# Altium schematic sheet Power.SchDoc: Sample Sheet Title
size B; Date: MM/DD/YYYY; Author: Sample Author; Organization: ORGANIZATION; Address1: ADDRESS 1; Address2: ADDRESS 2; Address3: ADDRESS 3; Address4: ADDRESS 4; Revision: -; SheetNumber: 5; SheetTotal: 7; ENG_APP_DATE: --/--/--; DSN_APP_DATE: --/--/--; CHK_APP_DATE: --/--/--
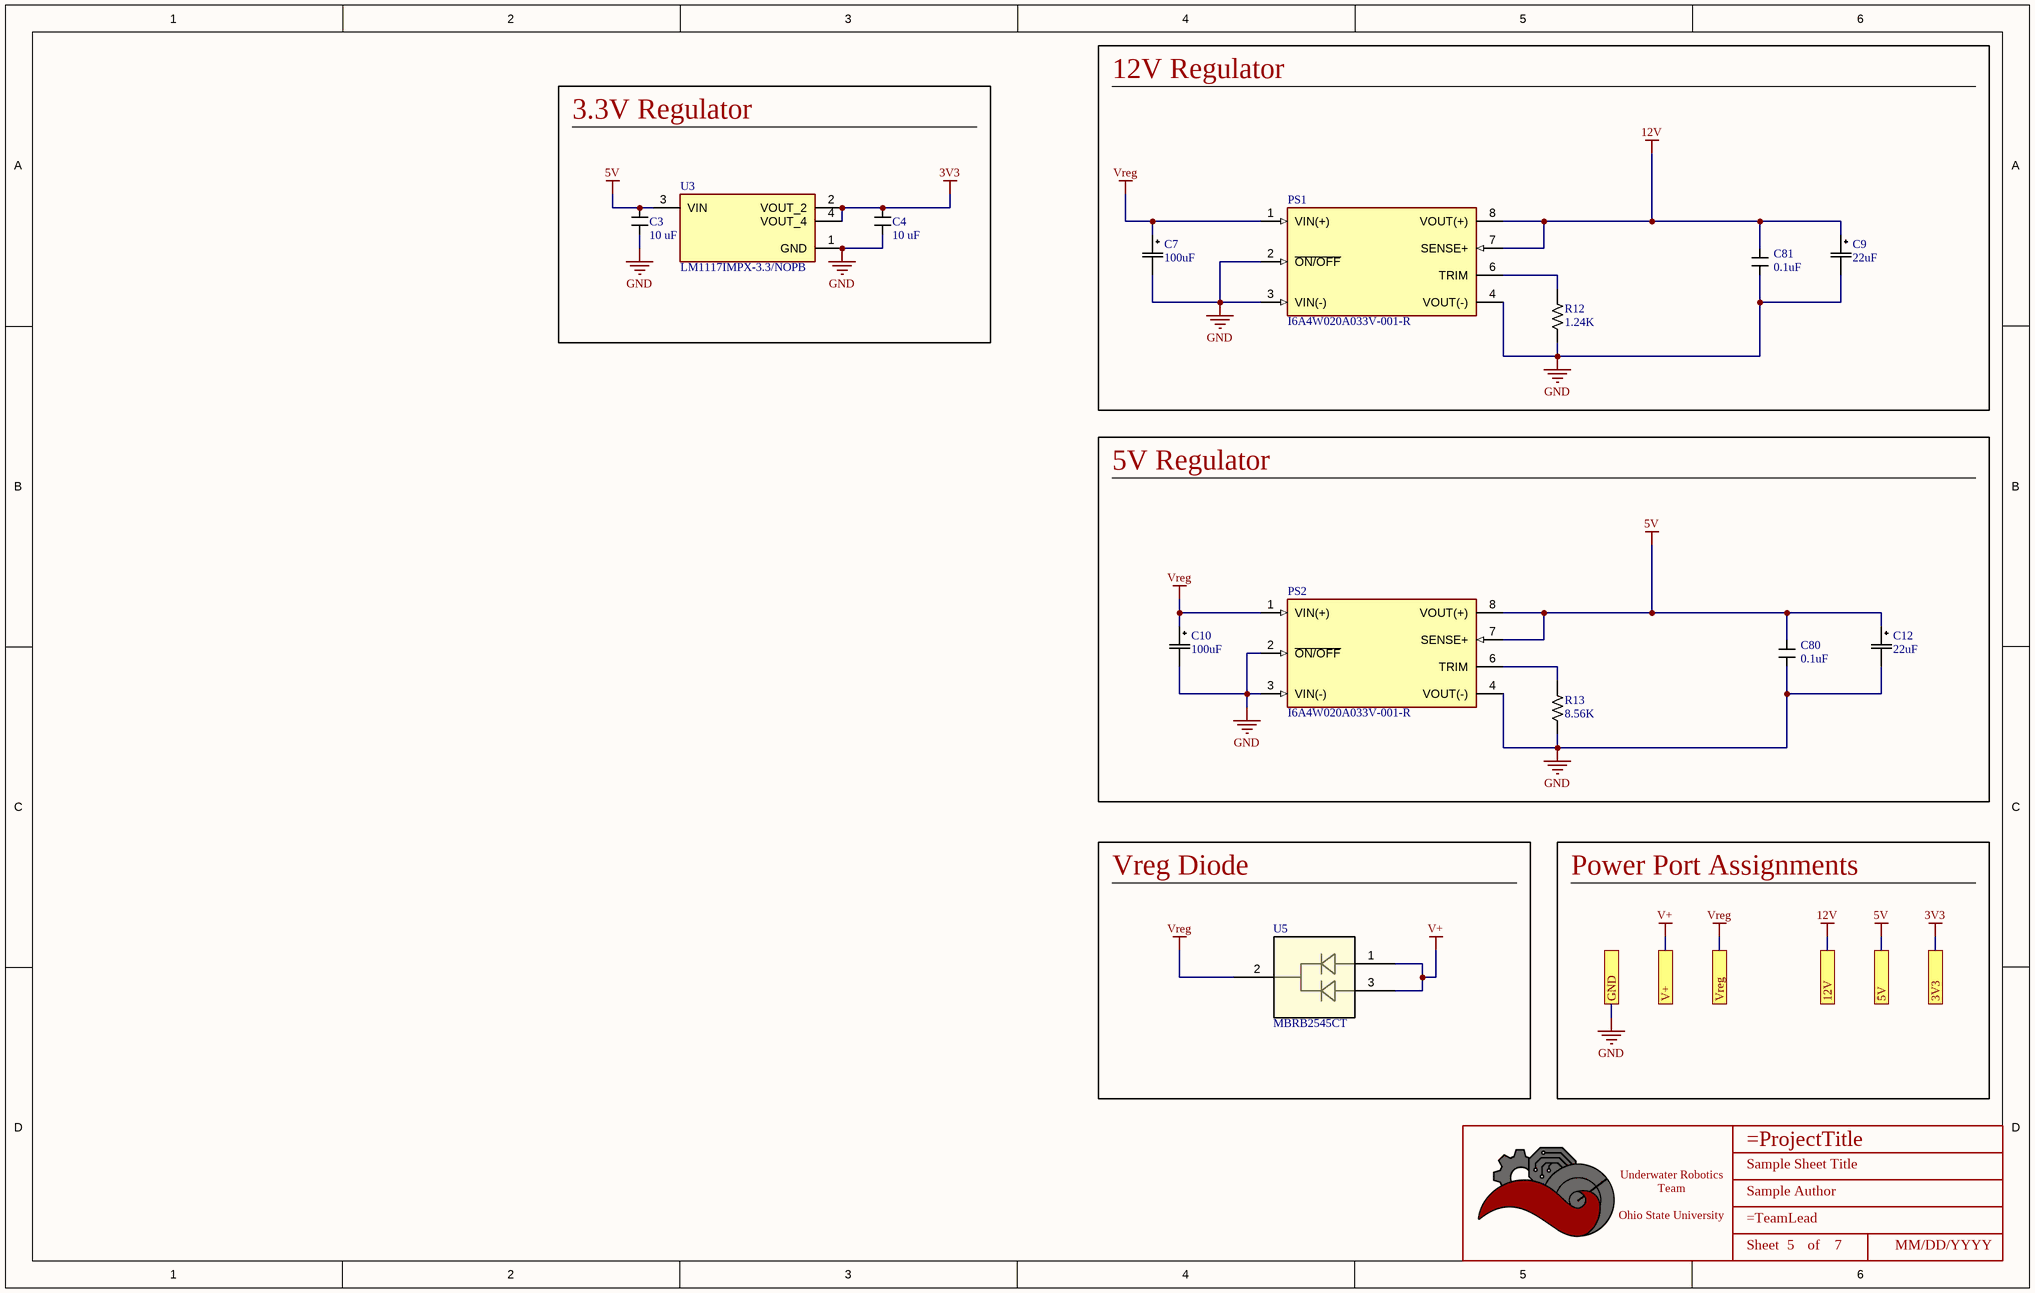
[diagram p0: Power.SchDoc]

## Parts
*  Title_Block  [LOGO]  (value not drawn)  (graphical)
C3  Value (uF): 10 uF  [CAPACITOR_0603]  (hidden comment: 10uF Ceramic 6.3V)
C4  Value (uF): 10 uF  [CAPACITOR_0603]  (hidden comment: 10uF Ceramic 6.3V)
C7  value 100uF  [PCAP_8x5.4-ELECT_NCA]  (hidden comment: 100uF electrolytic 35 V)
C9  value 22uF  [PCAP_8x5.4-ELECT_NCA]  (hidden comment: 22uF electrolytic 35 V)
C10  value 100uF  [PCAP_8x5.4-ELECT_NCA]  (hidden comment: 100uF electrolytic 35 V)
C12  value 22uF  [PCAP_8x5.4-ELECT_NCA]  (hidden comment: 22uF electrolytic 35 V)
C80  Capacitance: 0.1uF  [CAPACITOR_0402]  (hidden comment: CL05A104KA5NNNC)
C81  Capacitance: 0.1uF  [CAPACITOR_0402]  (hidden comment: CL05A104KA5NNNC)
PS1  I6A4W020A033V-001-R  [CONV_I6A4W020A033V-001-R]
PS2  I6A4W020A033V-001-R  [CONV_I6A4W020A033V-001-R]
R12  Value (Ohms): 1.24K  [RESISTOR_0603]  (hidden comment: RES 1.24K OHM 1% 1/10W 0603)
R13  Value (Ohms): 8.56K  [RESISTOR_0402]  (hidden comment: RES 8.56K OHM 1% 1/16W 0402)
U3  LM1117IMPX-3.3/NOPB  [SOT-223-4]
U5  MBRB2545CT  [D2PAK_VIS]

## Blocks framed on the sheet
12V Regulator: C7 C9 C81 PS1 R12
3.3V Regulator: C3 C4 U3
5V Regulator: C10 C12 C80 PS2 R13
Vreg Diode: U5

## Ports
3V3, 5V, 12V, GND, V+, Vreg

## Nets
3V3: C4.1 U3.2(VOUT_2) U3.4(VOUT_4) ; port 3V3
5V: C3.1 C12.1 C80.1 PS2.7(SENSE+) PS2.8(VOUT(+)) U3.3(VIN) ; port 5V
12V: C9.1 C81.1 PS1.7(SENSE+) PS1.8(VOUT(+)) ; port 12V
GND: C3.2 C4.2 C7.2 C9.2 C10.2 C12.2 C80.2 C81.2 PS1.2(~{ON/OFF}) PS1.3(VIN(-)) PS1.4(VOUT(-)) PS2.2(~{ON/OFF}) PS2.3(VIN(-)) PS2.4(VOUT(-)) R12.2 R13.2 U3.1(GND) ; port GND
V+: U5.1 U5.3 ; port V+
Vreg: C7.1 C10.1 PS1.1(VIN(+)) PS2.1(VIN(+)) U5.2 ; port Vreg
NetPS1_6: PS1.6(TRIM) R12.1
NetPS2_6: PS2.6(TRIM) R13.1

## Notes on the sheet
- Power Port Assignments
- DWG. NO.
- REV.
- SHT.
- THIS DOCUMENT AND THE DATA DISCLOSED HEREIN OR HEREWITH IS THE PROPERTY OF ALTIUM LIMITED AND MAY BE FREELY DISTRIBUTED IN WHOLE. NO RIGHTS ARE RESERVED OR EXPRESS OR IMPLIED WARANTEE GIVEN.
- REVISION
- DESCRIPTION
- DATE
- APPROVED
- ENG:
- APPROVALS
- PROJECT
- DSN:
- CHK:
- REFERENCE DOCUMENTS
- PROJECT REVISION:
- TITLE
- DOCUMENT REVISION:
- DESIGN ITEM:
- BOM:
- FAB DWG:
- PCB DWG:
- ASSY DWG:
- SCALE:
- SIZE
- B
- CAGE CODE
- FILE NAME
- DWG NO.
- SHEET
- OF
- REV
- (in symbol Title_Block) Underwater Robotics Team / Ohio State University; Sheet; of

## Library data of the parts
* = Title_Block: UWRT Schematic Title Block Template / Created June 2021, Dylan Trainor
C3 C4 = CAPACITOR_10uF_0603: Cap 10uF 6.3V +/-20% / Ceramic 0603; Made By: Flip B; ComponentLink1Description: Digikey; ComponentLink1URL: https://www.digikey.com/en/products/detail/samsung-electro-mechanics/CL10A106MQ8NNNC/3886777; Supplier 1: Digi-Key; Supplier Part Number 1: 1276-1119-1-ND; Tolerance: +/- 20%; Voltage: 6.3V
C7 C10 = CAP ALUM 100UF 20% 35V SMD: 100 µF 35 V Aluminum Electrolytic Capacitors Radial, Can - SMD 1000 Hrs; Mfr_Name: Nichicon; Manufacturer_Part_Number: UCB1V0R1MCL1GS; Type: DEV; Made by: Tyson Nguyen; Copyright: Copyright (C) 2022 Ultra Librarian. All rights reserved.; RefDes: RefDes; Supplier 1: Mouser; Supplier Part Number 1: 667-EEE-1VA101XP
C9 C12 = CAP ALUM 22UF 20% 35V SMD: 22 µF 35 V Aluminum Electrolytic Capacitors Radial, Can - SMD 1000 Hrs; Made by: Robert Pafford; Voltage: 35V; Supplier 1: Digi-Key; Supplier Part Number 1: PCE3952DKR-ND
C80 C81 = CAP CER 0.1UF 25V X5R 0402: 0.1 µF ±10% 25V Ceramic Capacitor X5R 0402 (1005 Metric); Name: Zach Ramsey; Tolerance: +/- 10%; ComponentLink1Description: Data Sheet; ComponentLink1URL: https://mm.digikey.com/Volume0/opasdata/d220001/medias/docus/503/CL05A104KA5NNNC.pdf; Rated Voltage: 25V
  C80: Supplier 1: Avnet; Supplier Part Number 1: CL05A104KA5NNNC
  C81: Supplier 1: Digikey; Supplier Part Number 1: 1276-1043-1-ND
PS1 PS2 = I6A4W020A033V-001-R: Non-Isolated PoL Module DC DC Converter 1 Output 3.3 ~ 15V 20A 9V - 53V Input; MF: TDK-Lambda Americas; Availability: In Stock; Price: None; Package: DIP-8 TDK-Lambda; MP: I6A4W020A033V-001-R; Value: *; SnapEDA_Link: https://www.snapeda.com/parts/I6A4W020A033V-001-R/TDK-Lambda%20Americas%20Inc./view-part/1737324/?ref=snap; Check_prices: https://www.snapeda.com/parts/I6A4W020A033V-001-R/TDK-Lambda%20Americas%20Inc./view-part/1737324/?ref=eda; Purchase-URL: https://pricing.snapeda.com/search/part/I6A4W020A033V-001-R/?ref=eda
R12 = RESISTOR_1.24K_1%_0603: 1.24 kOhms ±1% 0.1W, 1/10W Chip Resistor 0603 (1608 Metric) Automotive AEC-Q200 Thick Film; Tolerance: +/- 1%; Wattage: 1/10W; Created By: John Ulm; Verified By: *; Supplier 1: Digi-Key; Supplier Part Number 1: RMCF0603FT1K24CT-ND
R13 = RESISTOR_8.56K_1%_0402: 8.56 kOhms ±1% 0.063W, 1/16W Chip Resistor 0402 (1005 Metric) Automotive AEC-Q200, Moisture Resistant Metal Film; Tolerance: +/- 1%; Made By: John Ulm; Supplier 1: Digi-Key; Supplier Part Number 1: 2019-RN73H1ETTP8561F50CT-ND; Wattage: 1/16W; Verified By: *
U3 = LM1117IMPX-3.3/NOPB: 800-mA 15-V linear voltage regulator 4-SOT-223 -40 to 125; MF: Texas Instruments; Texas_Instruments-Purchase-URL: https://snapeda.com/shop?store=Texas+Instruments&id=410186; Price: None; Mouser-Purchase-URL: https://snapeda.com/shop?store=Mouser&id=410186; MP: LM1117IMPX-3.3/NOPB; Value: *; Availability: Good; Package: SOT-223-4 Texas Instruments; Arrow_Electronics-Purchase-URL: https://snapeda.com/shop?store=Arrow+Electronics&id=410186; SnapEDA_Link: https://www.snapeda.com/parts/LM1117IMPX-3.3/NOPB/Texas%20Instruments/view-part/410186/?ref=snap; DigiKey-Purchase-URL: https://snapeda.com/shop?store=DigiKey&id=410186
U5 = MBRB2545CT: Diode Array 1 Pair Common Cathode 45 V Surface Mount TO-263-3, D²Pak (2 Leads + Tab), TO-263AB; Mfr_Name: Vishay; Copyright: Copyright (C) 2023 Ultra Librarian. All rights reserved.; Manufacturer_Part_Number: MBRB2545CT; RefDes: RefDes; Type: DEV; ComponentLink1Description: Supplier Link; ComponentLink1URL: https://www.digikey.com/en/products/detail/smc-diode-solutions/MBRB2545CT/6022901